# EAGLE design shieldrasp (EAGLE 9.5.0)
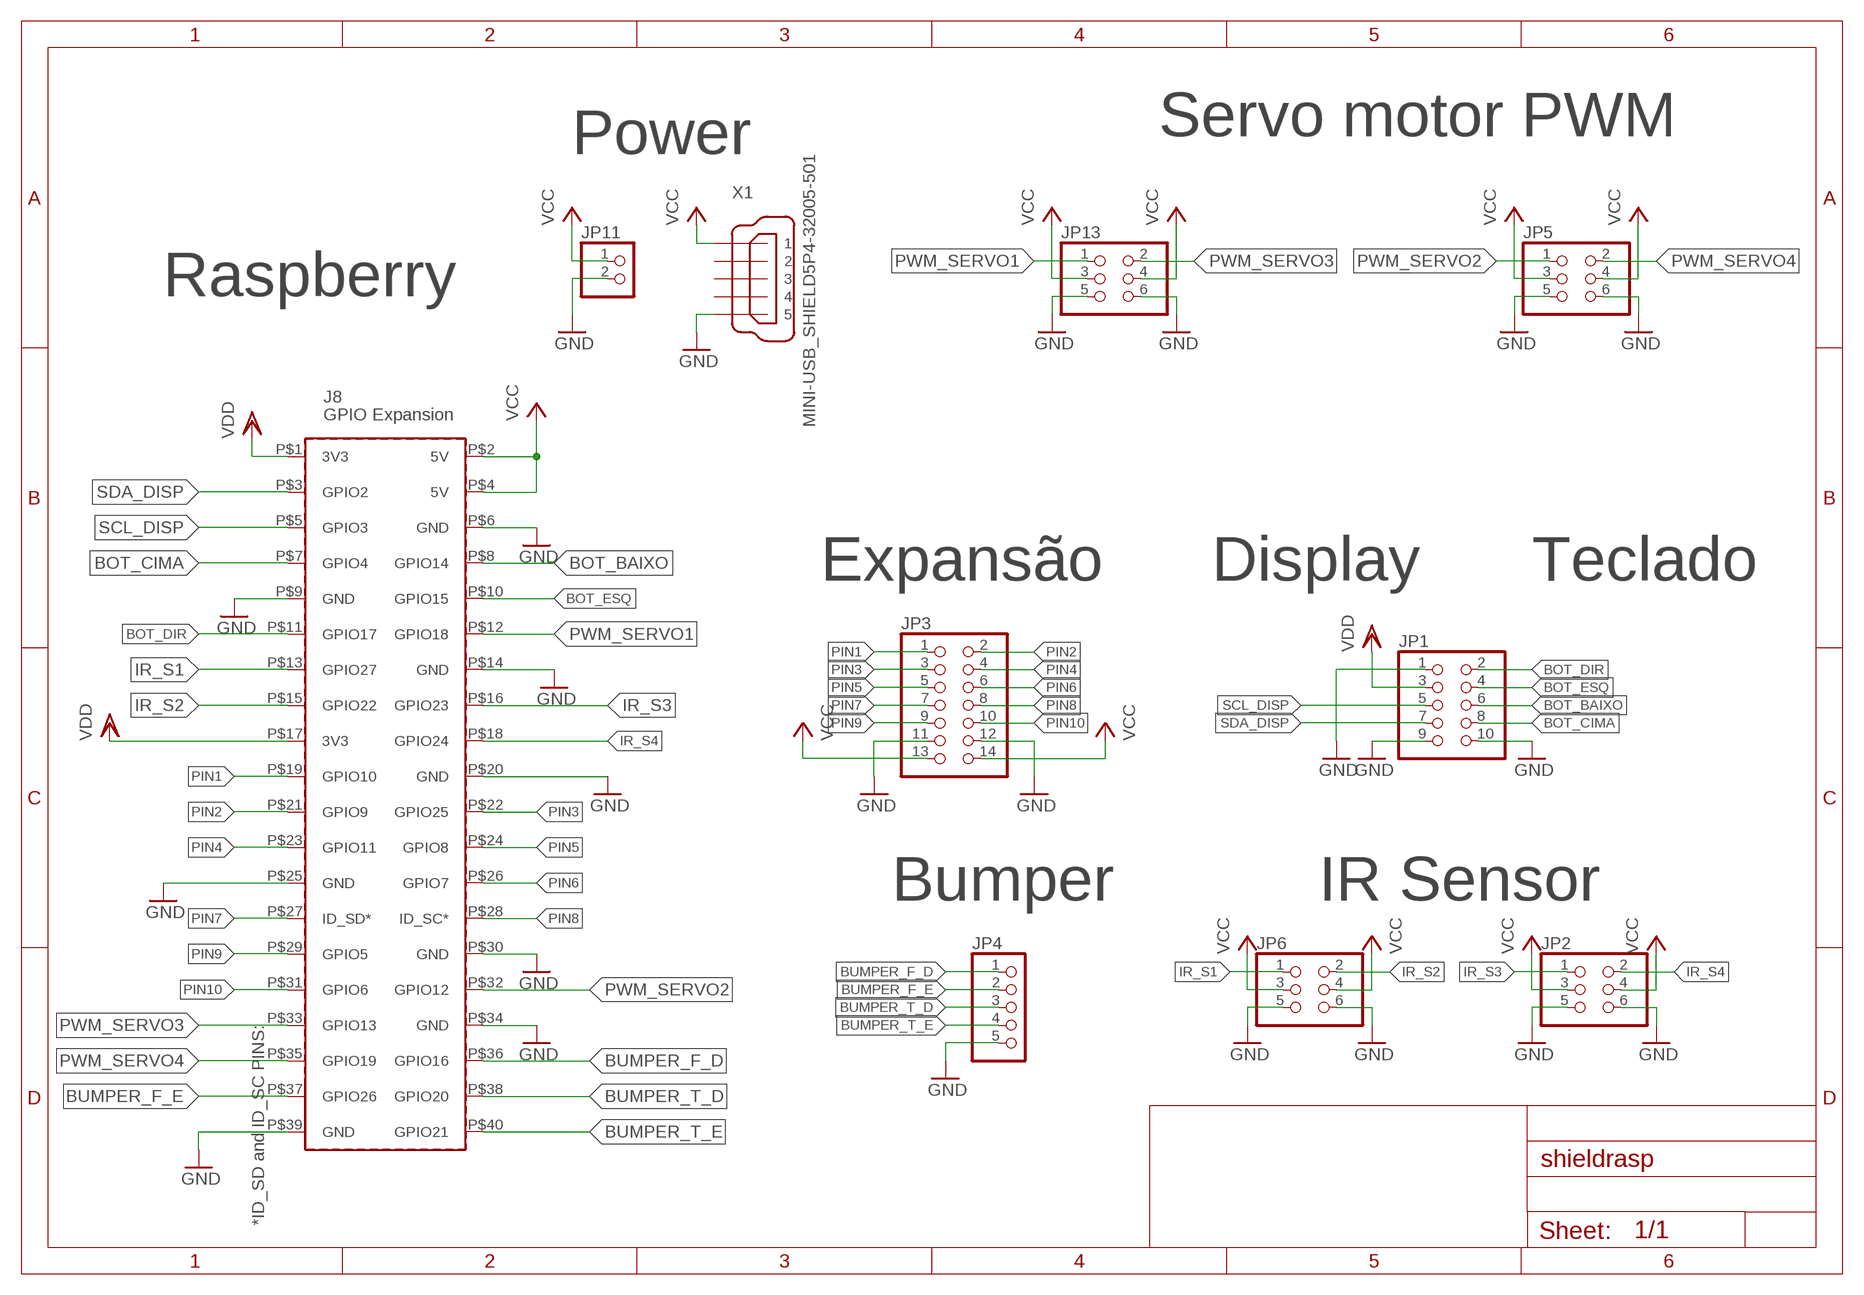
[diagram p0: schematic, sheet 1]

## Parts
JP1  PINHD-2X5/90  [2X05/90]
JP2  PINHD-2X3/90  [2X03/90]
JP3  PINHD-2X7  [2X07]
JP4  PINHD-1X5/90  [1X05/90]
JP5  PINHD-2X3/90  [2X03/90]
JP6  PINHD-2X3/90  [2X03/90]
JP11  PINHD-1X2/90  [1X02/90]
JP13  PINHD-2X3/90  [2X03/90]
PCB1  RPI3RPI3  [RPI3]
X1  MINI-USB_SHIELD5P4-32005-501  [32005-501]

## Nets
BOT_BAIXO: JP1.6 PCB1.P$8(GPIO14)
BOT_CIMA: JP1.8 PCB1.P$7(GPIO4)
BOT_DIR: JP1.2 PCB1.P$11(GPIO17)
BOT_ESQ: JP1.4 PCB1.P$10(GPIO15)
BUMPER_F_D: JP4.1 PCB1.P$36(GPIO16)
BUMPER_F_E: JP4.2 PCB1.P$37(GPIO26)
BUMPER_T_D: JP4.3 PCB1.P$38(GPIO20)
BUMPER_T_E: JP4.4 PCB1.P$40(GPIO21)
GND: JP1.1 JP1.9 JP1.10 JP2.5 JP2.6 JP3.11 JP3.12 JP4.5 JP5.5 JP5.6 JP6.5 JP6.6 JP11.2 JP13.5 JP13.6 PCB1.P$6(GND) PCB1.P$9(GND) PCB1.P$14(GND) PCB1.P$20(GND) PCB1.P$25(GND) PCB1.P$30(GND) PCB1.P$34(GND) PCB1.P$39(GND) X1.5
IR_S1: JP6.1 PCB1.P$13(GPIO27)
IR_S2: JP6.2 PCB1.P$15(GPIO22)
IR_S3: JP2.1 PCB1.P$16(GPIO23)
IR_S4: JP2.2 PCB1.P$18(GPIO24)
PIN1: JP3.1 PCB1.P$19(GPIO10)
PIN2: JP3.2 PCB1.P$21(GPIO9)
PIN3: JP3.3 PCB1.P$22(GPIO25)
PIN4: JP3.4 PCB1.P$23(GPIO11)
PIN5: JP3.5 PCB1.P$24(GPIO8)
PIN6: JP3.6 PCB1.P$26(GPIO7)
PIN7: JP3.7 PCB1.P$27(ID_SD*)
PIN8: JP3.8 PCB1.P$28(ID_SC*)
PIN9: JP3.9 PCB1.P$29(GPIO5)
PIN10: JP3.10 PCB1.P$31(GPIO6)
PWM_SERVO1: JP13.1 PCB1.P$12(GPIO18)
PWM_SERVO2: JP5.1 PCB1.P$32(GPIO12)
PWM_SERVO3: JP13.2 PCB1.P$33(GPIO13)
PWM_SERVO4: JP5.2 PCB1.P$35(GPIO19)
SCL_DISP: JP1.5 PCB1.P$5(GPIO3)
SDA_DISP: JP1.7 PCB1.P$3(GPIO2)
VCC: JP2.3 JP2.4 JP3.13 JP3.14 JP5.3 JP5.4 JP6.3 JP6.4 JP11.1 JP13.3 JP13.4 PCB1.P$2(5V) PCB1.P$4(5V) X1.1
VDD: JP1.3 PCB1.P$1(3V3) PCB1.P$17(3V3)
Unconnected: X1.2 X1.3 X1.4 X1.M1(S1) X1.M2(S2) X1.M3(S3) X1.M4(S4)

## Notes on the sheet
- Power | Servo motor PWM
- Raspberry
- Expansão | Display | Teclado
- Bumper | IR Sensor

## Library data of the parts
JP1 = pinhead:PINHD-2X5: PIN HEADER
JP2 JP5 JP6 JP13 = pinhead:PINHD-2X3: PIN HEADER
JP3 = pinhead:PINHD-2X7: PIN HEADER
JP4 = pinhead:PINHD-1X5: PIN HEADER
JP11 = pinhead:PINHD-1X2: PIN HEADER
PCB1 = e14_Rpi3_RevA+mirror-pcb:RPI3: Device for Raspberry Pi 3 board created by Dave Young for www.element14.com More information and support community is available at https://www.element14.com/community/community/raspberry-pi Device for Raspberry Pi 3 board updated by Gerald Schwarz for www.element14.com On RPI3 addet the layer milling and created a mirrored shield.
X1 = con-cypressindustries:MINI-USB_SHIELD5P4-: MINI USB-B R/A W/O POST 5 pol. Source: www.cypressindustries.com; OC_FARNELL: unknown; OC_NEWARK: unknown

## Board
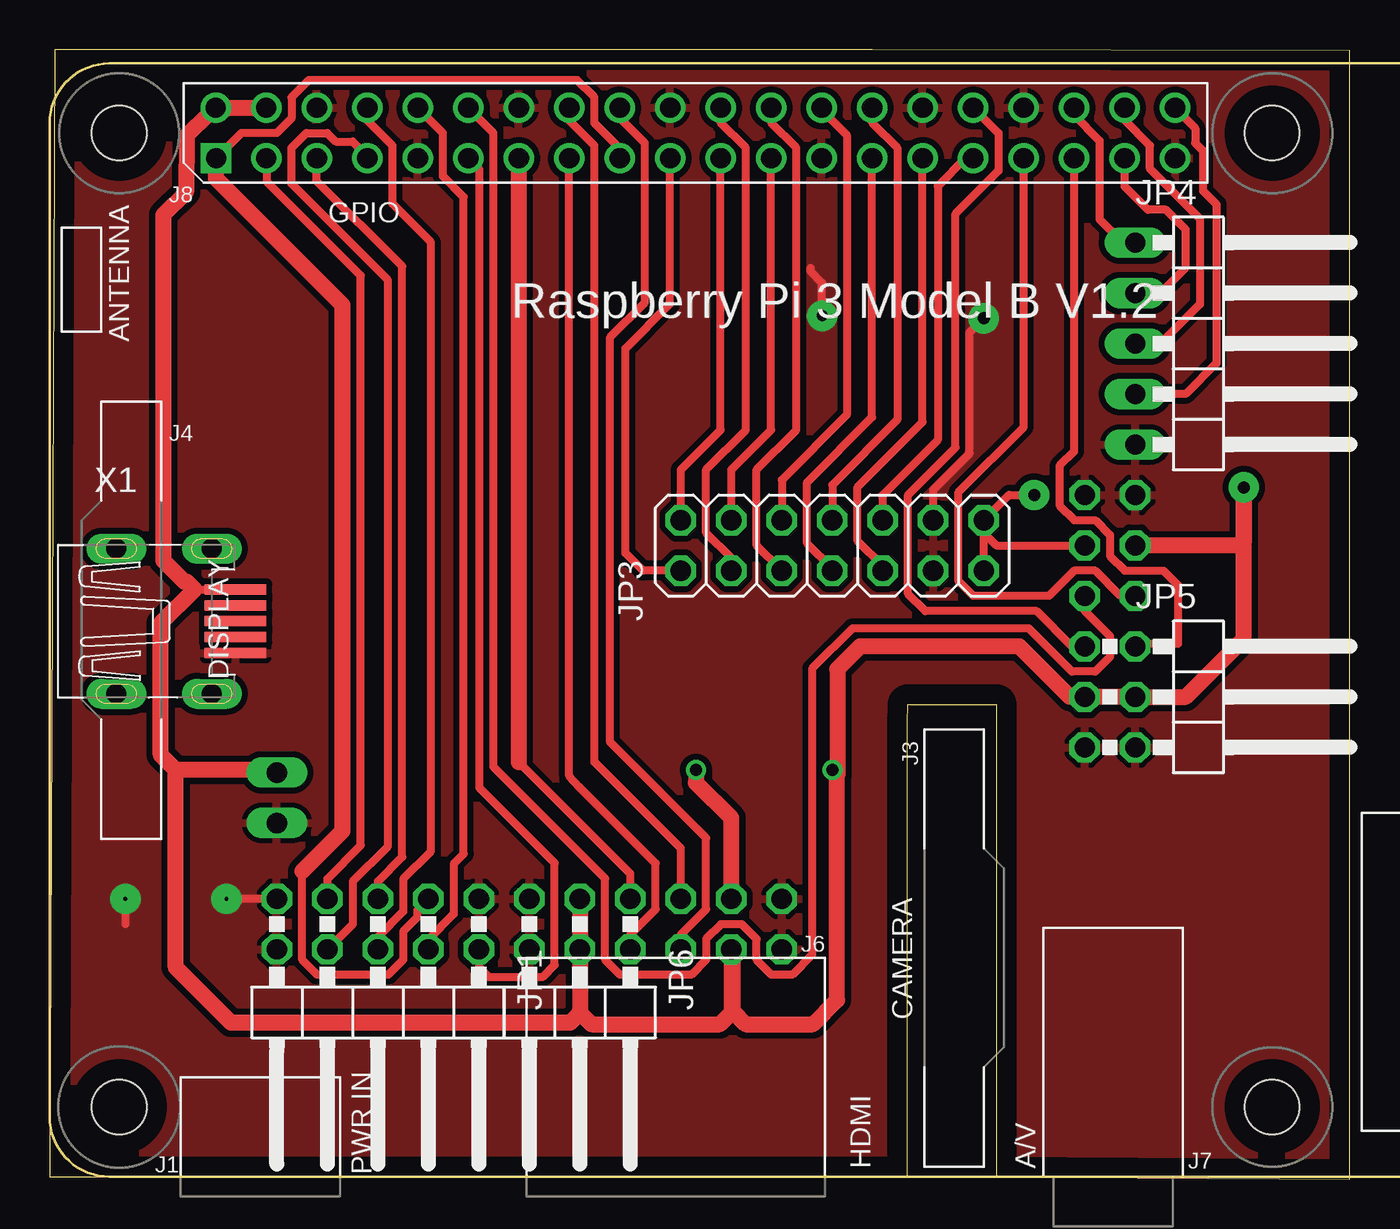
[diagram p1: board, top side]
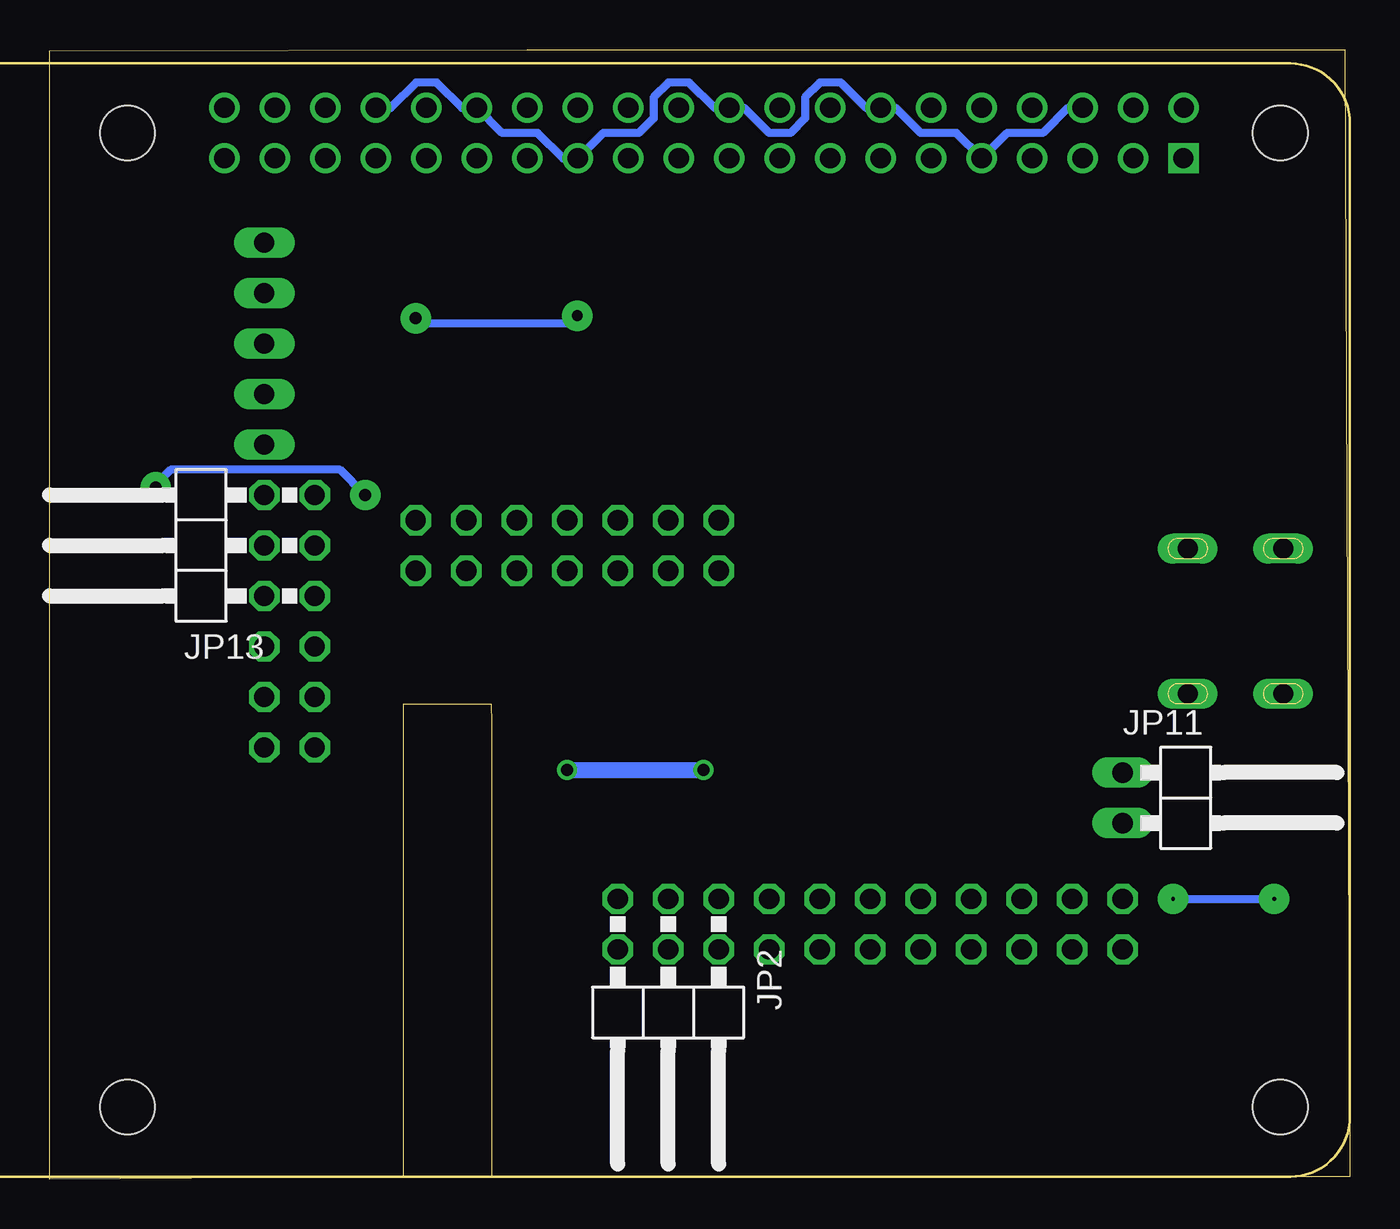
[diagram p2: board, bottom side, seen from below]

Size 65.41 x 56.82 mm. Coordinates in mm from the lower left corner, seen from the top.
Outline: 0,0.13 43.16,0.13 43.16,22.97 43.18,23.88 47.62,23.88 47.62,0.13 65.41,0 65.41,56.77 41.38,56.82 0.25,56.82 0,0.13
Copper layers (1*16): Top 0.035mm / dielectric 1.5mm / Bottom 0.035mm
Design rules "default *": minimum track width 16mil, minimum drill 0.35mm, track to track 12mil, track to pad 12mil, pad to pad 12mil, via to via 12mil, smd to smd 12mil, copper to edge 40mil, drill to drill 6mil, minimum pad ring 10mil, minimum via ring 8mil, stop-mask expansion 4mil, vias tented up to drill 0mil, thermal gap 10mil

### Footprints (pad centres in the part's own frame; a part is rotated, then mirrored left to right if it is on the bottom)
2X05/90 = drill 1.016 octagon: 1 -5.08,-6.35; 2 -5.08,-3.81; 3 -2.54,-6.35; 4 -2.54,-3.81; 5 0,-6.35; 6 0,-3.81; 7 2.54,-6.35; 8 2.54,-3.81; 9 5.08,-6.35; 10 5.08,-3.81
2X03/90 = drill 1.016 octagon: 1 -2.54,-6.35; 2 -2.54,-3.81; 3 0,-6.35; 4 0,-3.81; 5 2.54,-6.35; 6 2.54,-3.81
2X07 = drill 1.016 octagon: 1 -7.62,-1.27; 2 -7.62,1.27; 3 -5.08,-1.27; 4 -5.08,1.27; 5 -2.54,-1.27; 6 -2.54,1.27; 7 0,-1.27; 8 0,1.27; 9 2.54,-1.27; 10 2.54,1.27; 11 5.08,-1.27; 12 5.08,1.27; 13 7.62,-1.27; 14 7.62,1.27
1X05/90 = drill 1.016 long: 1 -5.08,-3.81; 2 -2.54,-3.81; 3 0,-3.81; 4 2.54,-3.81; 5 5.08,-3.81
1X02/90 = drill 1.016 long: 1 -1.27,-3.81; 2 1.27,-3.81
RPI3 = drill 1.016 square: P$1 8.37,51.23 | drill 1.016: P$2 8.357,53.772; P$3 10.897,51.232; P$4 10.897,53.772; P$5 13.437,51.232; P$6 13.437,53.772; P$7 15.977,51.232; P$8 15.977,53.772; P$9 18.517,51.232; P$10 18.517,53.772; P$11 21.057,51.232; P$12 21.057,53.772; P$13 23.597,51.232; P$14 23.597,53.772; P$15 26.137,51.232; P$16 26.137,53.772; P$17 28.677,51.232; P$18 28.677,53.772; P$19 31.217,51.232; P$20 31.217,53.772; P$21 33.757,51.232; P$22 33.757,53.772; P$23 36.297,51.232; P$24 36.297,53.772; P$25 38.837,51.232; P$26 38.837,53.772; P$27 41.377,51.232; P$28 41.377,53.772; P$29 43.917,51.232; P$30 43.917,53.772; P$31 46.457,51.232; P$32 46.457,53.772; P$33 48.997,51.232; P$34 48.997,53.772; P$35 51.537,51.232; P$36 51.537,53.772; P$37 54.077,51.232; P$38 54.077,53.772; P$39 56.617,51.232; P$40 56.617,53.772 | hole 2.75: 3.5,3.5; 61.5,3.5; 3.5,52.5; 61.5,52.5
32005-501 = smd 3.1 x 0.5: 1 3,1.6; 2 3,0.8; 3 3,0; 4 3,-0.8; 5 3,-1.6 | drill 1 pad 1.422 long: M1 -3,3.65; M2 -3,-3.65; M3 1.8,3.65; M4 1.8,-3.65

### Placement (x,y rotation side)
JP1  16.51,7.75 180 top
JP2  34.29,7.75 180 bottom
JP3  39.37,31.88 0 top
JP4  58.42,42.04 270 top
JP5  58.42,24.26 270 top
JP6  26.67,7.75 180 top
JP11  7.62,19.18 270 bottom
JP13  58.42,31.88 90 bottom
PCB1  0,0.13 0 top
X1  6.35,28.07 0 top

### Tracks (layer width: path | path; a pad name or v marks a point on that pad's centre or on a via)
BOT_BAIXO
  Top 0.406: JP1.6 16.51,12.19 17.78,13.46 17.78,15.1 19.18,16.49 19.18,47.13 17.25,49.06 17.25,51.99 15.98,53.26 PCB1.P$8
BOT_CIMA
  Top 0.406: JP1.8 15.24,12.83 15.24,14.97 17.02,16.75 17.02,45.22 12.17,50.07 12.17,51.88 12.91,52.63 13.96,52.63 14.39,52.2 15.24,52.2 15.98,51.46 PCB1.P$7
BOT_DIR
  Top 0.406: JP1.2 21.59,10.67 22.1,10.16 24.78,10.16 25.4,10.78 25.4,15.89 21.62,19.68 21.62,50.8 PCB1.P$11
BOT_ESQ
  Top 0.406: JP1.4 19.05,12.07 20.32,13.34 20.32,15.86 20.83,16.37 20.83,49.41 19.79,50.45 19.79,52.63 PCB1.P$10
BUMPER_F_D
  Top 0.406: JP4.1 53.34,47.76 52.81,48.29 52.81,52.25 51.54,53.52 PCB1.P$36
BUMPER_F_E
  Top 0.406: JP4.2 55.88,44.58 57.15,45.85 57.15,47.77 56.15,48.77 55.24,48.77 54.08,49.94 PCB1.P$37
BUMPER_T_D
  Top 0.406: PCB1.P$38 54.08,53.26 55.35,51.99 55.35,50.83 57.86,48.32 57.86,44.02 55.88,42.04 | JP4.3 55.88,42.04 | 55.88,42.04 56.01,42.04
BUMPER_T_E
  Top 0.406: PCB1.P$40 57.63,52.88 57.63,52.12 58.01,51.74 58.01,49.73 58.7,49.04 58.7,41.05 57.15,39.5 JP4.4
GND  (via drill 0.2 pad 1.52, 0.55 pad 1.52, 0.6 pad 1.52)
  Top 0.406: JP1.9 v8.89,14.1 | v3.81,14.1 3.81,12.83 | JP3.12 44.45,34.68 46.28,36.51 46.28,42.6 v46.99,43.31 | v38.86,43.43 38.86,45.09 38.28,45.67 38.28,45.85
  Bottom 0.406: v8.89,14.1 v3.81,14.1 | PCB1.P$6 14.18,53.9 15.45,52.63 17.25,52.63 PCB1.P$9 19.79,52.63 21.58,52.63 22.85,53.9 PCB1.P$14 24.34,53.9 25.61,55.17 26.66,55.17 27.41,54.43 27.41,53.37 28.15,52.63 29.2,52.63 30.47,53.9 PCB1.P$20 31.96,53.9 33.23,55.17 34.28,55.17 35.03,54.43 35.03,53.37 35.77,52.63 37.57,52.63 PCB1.P$25 39.58,51.36 40.85,52.63 42.65,52.63 PCB1.P$30 44.66,53.9 45.93,55.17 46.98,55.17 48.25,53.9 PCB1.P$34 | v46.99,43.31 46.74,43.05 38.86,43.05 v38.86,43.43
  pour Top: 0,57.28 0,0 65.41,0 65.41,57.28
IR_S1
  Top 0.406: JP6.1 29.21,15.37 23.6,20.98
  Top 0.813: PCB1.P$13 23.6,20.98
IR_S2
  Top 0.406: PCB1.P$15 26.14,20.3 26.66,19.71 30.48,15.89 30.48,13.57 29.21,12.3 JP6.2
IR_S3
  Top 0.406: PCB1.P$16 26.14,53.26 27.41,51.99 27.41,20.98 31.75,16.64 JP2.1
IR_S4
  Top 0.406: 31.77,11.56 JP2.2 31.75,12.3 33.02,13.57 33.02,17.16 28.19,21.99 28.19,42.35 29.95,44.1 29.95,52.12 28.68,53.39 PCB1.P$18
PIN1
  Top 0.406: JP3.1 29.84,30.61 28.96,31.5 28.96,41.78 31.22,44.04 PCB1.P$19
PIN2
  Top 0.406: JP3.2 31.75,35.69 33.76,37.69 PCB1.P$21
PIN3
  Top 0.406: PCB1.P$22 33.76,53.16 35.03,51.88 35.03,37.69 33.02,35.69 33.02,32.51 34.29,31.24 JP3.3
PIN4
  Top 0.406: PCB1.P$23 36.3,37.69 34.29,35.69 JP3.4
PIN5
  Top 0.406: JP3.5 35.56,31.88 35.56,35.69 37.57,37.69 37.57,51.88 36.3,53.16 PCB1.P$24
PIN6
  Top 0.406: PCB1.P$26 38.84,53.79 40.11,52.52 40.11,38.46 36.83,35.18 JP3.6
PIN7
  Top 0.406: JP3.7 39.37,30.72 38.1,31.99 38.1,35.05 41.38,38.33 PCB1.P$27
PIN8
  Top 0.406: JP3.8 39.37,34.93 42.65,38.2 42.65,51.88 41.38,53.16 PCB1.P$28
PIN9
  Top 0.406: PCB1.P$29 43.92,38.09 40.64,34.82 40.64,32.11 41.91,30.84 JP3.9
PIN10
  Top 0.406: JP3.10 41.91,34.42 44.68,37.19 44.68,49.96 46.08,51.36 PCB1.P$31
PWM_SERVO1
  Top 0.406: JP13.1 52.07,28.59 53.34,27.32 53.34,26.27 52.6,25.53 51.43,25.53 49.25,27.71 40.39,27.71 38.36,25.68 38.36,11.29 37.36,10.29 36.3,10.29 35.56,11.03 35.56,12.08 34.82,12.83 33.76,12.83 33.02,12.08 33.02,11.03 32.28,10.29 28.68,10.29 27.94,11.03 27.94,15.12 22.33,20.74 22.33,52.63 PCB1.P$12
PWM_SERVO2
  Top 0.406: JP5.1 51.43,26.8 49.66,28.58 44.05,28.58 43.18,29.45 43.18,34.42 45.57,36.8 45.57,48.56 47.73,50.72 47.73,52.63 PCB1.P$32
PWM_SERVO3
  Top 0.406: PCB1.P$33 49,37.84 45.72,34.56 45.72,30.08 46.46,29.34 50.27,29.34 51.54,30.61 52.6,30.61 53.87,29.34 JP13.2
PWM_SERVO4
  Top 0.406: JP5.2 54.74,26.92 56.77,26.92 56.77,29.86 56.02,30.61 54.08,30.61 53.34,31.35 53.34,32.4 52.6,33.15 51.54,33.15 50.8,33.89 50.8,35.89 51.54,36.63 PCB1.P$35
SCL_DISP
  Top 0.406: PCB1.P$5 13.44,50.22 17.73,45.92 17.73,16.21 16.51,14.99 JP1.5
SDA_DISP
  Top 0.406: JP1.7 13.97,15.11 15.65,16.79 15.65,45.46 10.95,50.16 10.95,51.31 PCB1.P$3
VCC  (via drill 0.6, 0.6 pad 1.52)
  Top 0.406: JP3.13 JP3.14 | JP3.14 46.99,32.51 47.62,31.88 JP13.3 | JP6.4 26.67,8.41 26.65,8.39 | PCB1.P$2 8.04,53.59 7.98,53.59 | 6.77,30.06 6.9,30.06 | 7.29,29.67 X1.1 | JP11.1 11.3,20.57 | JP5.3 51.32,24.26 | JP3.14 48.26,34.42 v49.53,34.42 | v39.37,20.57 39.61,20.33
  Top 0.813: JP5.3 JP5.4 57.15,24.26 60.07,27.18 v60.07,34.8 60.07,32 59.94,31.88 JP13.4 | JP6.3 JP6.4 26.67,8.36 26.18,7.87 9.13,7.87 6.35,10.65 6.35,20.57 | 26.65,8.39 27.25,7.8 33.71,7.8 34.29,8.37 JP2.4 34.34,11.51 34.34,8.47 35.01,7.8 38.39,7.8 39.61,9.02 39.61,20.33 | 7.98,53.59 6.9,52.51 6.86,49.66 5.71,48.51 5.71,31.12 6.77,30.06 | 11.3,20.57 6.35,20.57 | 6.35,20.57 5.59,21.34 5.59,27.97 7.29,29.67 6.9,30.06 | 51.32,24.26 48.78,26.8 40.77,26.8 39.62,25.65 39.62,20.32 v39.37,20.57 | v32.51,20.57 32.51,19.94 34.29,18.16 JP2.3 | PCB1.P$2 PCB1.P$4
  Bottom 0.406: v49.53,34.42 50.8,35.69 59.31,35.69 60.07,34.93 v60.07,34.8
  Bottom 0.813: v39.37,20.57 v32.51,20.57
VDD
  Top 0.406: JP1.3 18.49,13.54 18.49,13.17 17.78,12.46 17.78,11.03 17.04,10.29 13.44,10.29 12.7,11.03 12.7,15.48 | PCB1.P$17 28.55,51.36 28.5,51.41 28.5,52.03 27.41,53.13 27.41,54.43 26.54,55.3 13.04,55.3 12.17,54.43 12.17,53.37 11.42,52.63 9.64,52.63 PCB1.P$1
  Top 0.813: 12.7,15.48 14.73,17.52 14.73,43.98 8.37,50.34 PCB1.P$1